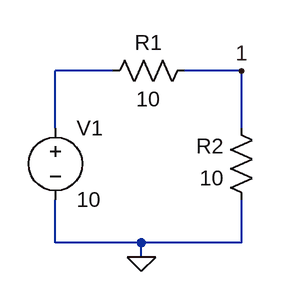
[diagram p0: schematic circuit-1.asc]
circuit-1.asc, the LTspice schematic file:
Version 4
SHEET 1 880 680
WIRE 112 96 48 96
WIRE 256 96 192 96
WIRE 48 160 48 96
WIRE 256 160 256 96
WIRE 48 288 48 240
WIRE 144 288 48 288
WIRE 256 288 256 240
WIRE 256 288 144 288
WIRE 144 304 144 288
FLAG 256 96 1
FLAG 144 304 0
SYMBOL res 208 80 R90
WINDOW 0 0 56 VBottom 2
WINDOW 3 32 56 VTop 2
SYMATTR InstName R1
SYMATTR Value 10
SYMBOL res 272 256 R180
WINDOW 0 36 76 Left 2
WINDOW 3 36 40 Left 2
SYMATTR InstName R2
SYMATTR Value 10
SYMBOL voltage 48 144 R0
SYMATTR InstName V1
SYMATTR Value 10

The netlist it stands for:
* circuit-1.asc
R1 1 N001 10
R2 0 1 10
V1 N001 0 10
.backanno
.end